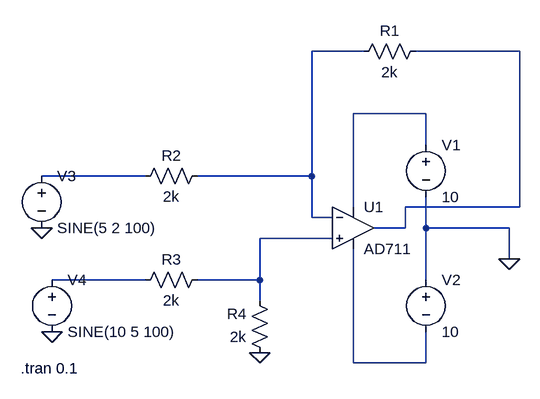
[diagram p0: schematic Diferential Amplifier.asc]
Diferential Amplifier.asc, the LTspice schematic file:
Version 4
SHEET 1 880 680
WIRE 240 -112 160 -112
WIRE 480 -112 320 -112
WIRE 336 -16 224 -16
WIRE 336 32 336 -16
WIRE -96 80 -256 80
WIRE 160 80 160 -112
WIRE 160 80 -16 80
WIRE 224 128 224 -16
WIRE 480 128 480 -112
WIRE 480 128 304 128
WIRE 160 144 160 80
WIRE 192 144 160 144
WIRE 304 160 304 128
WIRE 304 160 256 160
WIRE 336 160 336 112
WIRE 464 160 336 160
WIRE 192 176 80 176
WIRE 464 208 464 160
WIRE -96 240 -240 240
WIRE 80 240 80 176
WIRE 80 240 -16 240
WIRE 336 240 336 160
WIRE 80 272 80 240
WIRE 224 368 224 192
WIRE 336 368 336 320
WIRE 336 368 224 368
FLAG 464 208 0
FLAG 80 352 0
FLAG -256 160 0
FLAG -240 320 0
SYMBOL OpAmps\\AD711 224 96 R0
SYMATTR InstName U1
SYMBOL voltage 336 16 R0
SYMATTR InstName V1
SYMATTR Value 10
SYMBOL voltage 336 224 R0
SYMATTR InstName V2
SYMATTR Value 10
SYMBOL res 336 -128 R90
WINDOW 0 0 56 VBottom 2
WINDOW 3 32 56 VTop 2
SYMATTR InstName R1
SYMATTR Value 2k
SYMBOL res 0 64 R90
WINDOW 0 0 56 VBottom 2
WINDOW 3 32 56 VTop 2
SYMATTR InstName R2
SYMATTR Value 2k
SYMBOL res 0 224 R90
WINDOW 0 0 56 VBottom 2
WINDOW 3 32 56 VTop 2
SYMATTR InstName R3
SYMATTR Value 2k
SYMBOL res 96 368 R180
WINDOW 0 36 76 Left 2
WINDOW 3 36 40 Left 2
SYMATTR InstName R4
SYMATTR Value 2k
SYMBOL voltage -256 64 R0
WINDOW 123 0 0 Left 0
WINDOW 39 0 0 Left 0
SYMATTR InstName V3
SYMATTR Value SINE(5 2 100)
SYMBOL voltage -240 224 R0
WINDOW 123 0 0 Left 0
WINDOW 39 0 0 Left 0
SYMATTR InstName V4
SYMATTR Value SINE(10 5 100)
TEXT -288 376 Left 2 !.tran 0.1

The netlist it stands for:
* Diferential Amplifier.asc
XU1 N005 N001 N003 N007 N002 AD712  ; AD711, pins In+ In- V+ V- OUT
V1 N003 0 10
V2 0 N007 10
R1 N002 N001 2k
R2 N001 N004 2k
R3 N005 N006 2k
R4 0 N005 2k
V3 N004 0 SINE(5 2 100)
V4 N006 0 SINE(10 5 100)
.tran 0.1
.lib ADI1.lib
.backanno
.end